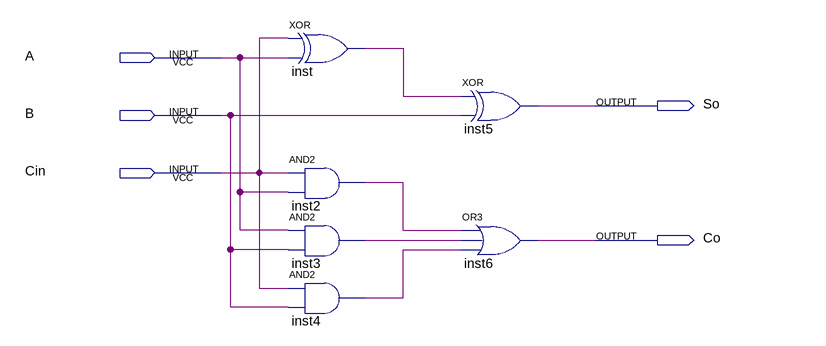
[diagram p0: schematic sheet]
// Quartus schematic Full_Adder.bdf as structural Verilog: 6 symbols, 5 pins
module Full_Adder (
  input  A,
  input  B,
  input  Cin,
  output So,
  output Co
);

  wire inst2_out, inst3_out, inst4_out, inst_out;

  xor inst (inst_out, Cin, A);
  and inst2 (inst2_out, Cin, A);
  and inst3 (inst3_out, A, B);
  and inst4 (inst4_out, Cin, B);
  xor inst5 (So, inst_out, B);
  or inst6 (Co, inst2_out, inst3_out, inst4_out);
endmodule
